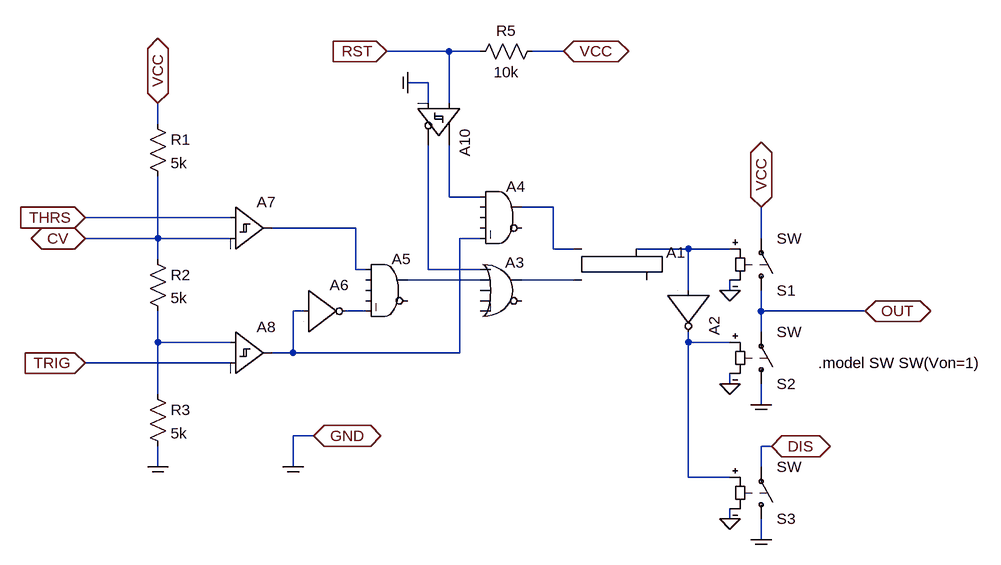
[diagram p0: schematic 555g.asc]
555g.asc, the LTspice schematic file:
Version 4
SHEET 1 1852 680
WIRE 704 -160 608 -160
WIRE 752 -160 704 -160
WIRE 880 -160 832 -160
WIRE 672 -112 640 -112
WIRE 672 -80 672 -112
WIRE 704 -80 704 -160
WIRE 256 -48 256 -80
WIRE 704 64 704 -16
WIRE 752 64 704 64
WIRE 864 80 816 80
WIRE 368 96 144 96
WIRE 560 112 432 112
WIRE 256 128 256 32
WIRE 256 128 144 128
WIRE 368 128 256 128
WIRE 752 128 720 128
WIRE 1184 128 1184 80
WIRE 864 144 864 80
WIRE 896 144 864 144
WIRE 1072 144 992 144
WIRE 1136 144 1072 144
WIRE 256 160 256 128
WIRE 560 176 560 112
WIRE 576 176 560 176
WIRE 672 176 672 -16
WIRE 752 176 672 176
WIRE 752 192 640 192
WIRE 896 192 816 192
WIRE 1072 208 1072 144
WIRE 1136 208 1136 192
WIRE 480 240 464 240
WIRE 576 240 544 240
WIRE 1184 240 1184 208
WIRE 1344 240 1184 240
WIRE 1184 272 1184 240
WIRE 256 288 256 240
WIRE 368 288 256 288
WIRE 1072 288 1072 272
WIRE 1136 288 1072 288
WIRE 464 304 464 240
WIRE 464 304 432 304
WIRE 720 304 720 128
WIRE 720 304 464 304
WIRE 368 320 144 320
WIRE 1136 352 1136 336
WIRE 256 368 256 288
WIRE 1184 384 1184 352
WIRE 496 432 464 432
WIRE 1200 448 1184 448
WIRE 256 480 256 448
WIRE 464 480 464 432
WIRE 1184 480 1184 448
WIRE 1072 496 1072 288
WIRE 1136 496 1072 496
WIRE 1136 560 1136 544
WIRE 1184 592 1184 560
FLAG 256 480 COM
FLAG 144 128 CV
IOPIN 144 128 BiDir
FLAG 144 96 THRS
IOPIN 144 96 In
FLAG 144 320 TRIG
IOPIN 144 320 In
FLAG 256 -80 VCC
IOPIN 256 -80 BiDir
FLAG 608 -160 RST
IOPIN 608 -160 In
FLAG 464 480 COM
FLAG 496 432 GND
IOPIN 496 432 BiDir
FLAG 880 -160 VCC
IOPIN 880 -160 BiDir
FLAG 640 -112 COM
FLAG 1136 208 0
FLAG 1136 352 0
FLAG 1184 384 COM
FLAG 1184 80 VCC
IOPIN 1184 80 BiDir
FLAG 1136 560 0
FLAG 1184 592 COM
FLAG 1200 448 DIS
IOPIN 1200 448 BiDir
FLAG 1344 240 OUT
IOPIN 1344 240 BiDir
SYMBOL Digital\\srflop 944 96 R0
SYMATTR InstName A1
SYMBOL res 240 -64 R0
SYMATTR InstName R1
SYMATTR Value 5k
SYMBOL res 240 144 R0
SYMATTR InstName R2
SYMATTR Value 5k
SYMBOL res 240 352 R0
SYMATTR InstName R3
SYMATTR Value 5k
SYMBOL Digital\\or 784 144 R0
WINDOW 0 6 21 Left 2
SYMATTR InstName A3
SYMBOL Digital\\and 784 32 R0
SYMATTR InstName A4
SYMBOL Digital\\and 608 144 R0
SYMATTR InstName A5
SYMBOL Digital\\inv 480 176 R0
SYMATTR InstName A6
SYMBOL res 848 -176 R90
WINDOW 0 0 56 VBottom 2
WINDOW 3 32 56 VTop 2
SYMATTR InstName R5
SYMATTR Value 10k
SYMBOL Digital\\diffschmtbuf 368 48 R0
WINDOW 3 8 44 Invisible 2
SYMATTR Value Vt=0 Td=1n
SYMATTR InstName A7
SYMBOL Digital\\diffschmtbuf 368 240 R0
WINDOW 3 8 44 Invisible 2
SYMATTR Value Vt=0 Td=1n
SYMATTR InstName A8
SYMBOL Digital\\diffschmitt 752 -80 R90
SYMATTR InstName A10
SYMBOL sw 1184 224 M180
SYMATTR InstName S1
SYMBOL Digital\\inv 1136 208 R90
SYMATTR InstName A2
SYMBOL sw 1184 368 M180
SYMATTR InstName S2
SYMBOL sw 1184 576 M180
SYMATTR InstName S3
TEXT 1272 320 Left 2 !.model SW SW(Von=1)

The netlist it stands for:
* 555g.asc
A1 N002 N008 0 0 0 0 N005 0 SRFLOP
R1 VCC CV 5k
R2 CV N010 5k
R3 N010 GND 5k
A3 N006 N007 0 0 0 0 N008 0 OR
A4 N001 0 0 0 N004 0 N002 0 AND
A5 N003 0 0 0 N009 0 N007 0 AND
A6 N004 0 0 0 0 N009 0 0 BUF
R5 VCC RST 10k
A7 THRS CV 0 0 0 0 N003 0 SCHMITT Vt=0 Td=1n
A8 N010 TRIG 0 0 0 0 N004 0 SCHMITT Vt=0 Td=1n
A10 RST GND 0 0 0 N006 N001 0 SCHMITT
S1 OUT VCC N005 0 SW
A2 N005 0 0 0 0 N011 0 0 BUF
S2 GND OUT N011 0 SW
S3 GND DIS N011 0 SW
.model SW SW(Von=1)
.backanno
.end